# Altium schematic sheet HOLE.SchDoc
size A
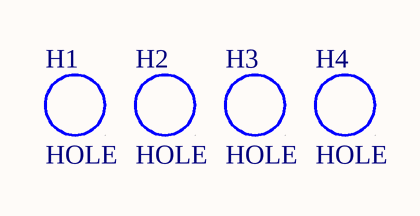
[diagram p0: HOLE.SchDoc]

## Parts
H1  HOLE  [DE_VIT]
H2  HOLE  [DE_VIT]
H3  HOLE  [DE_VIT]
H4  HOLE  [DE_VIT]

## Nets

Not connected (* = marked no-connect by the designer): H1 1; H2 1; H3 1; H4 1